# EAGLE design NDIR_SensorInterface (EAGLE 9.6.2)
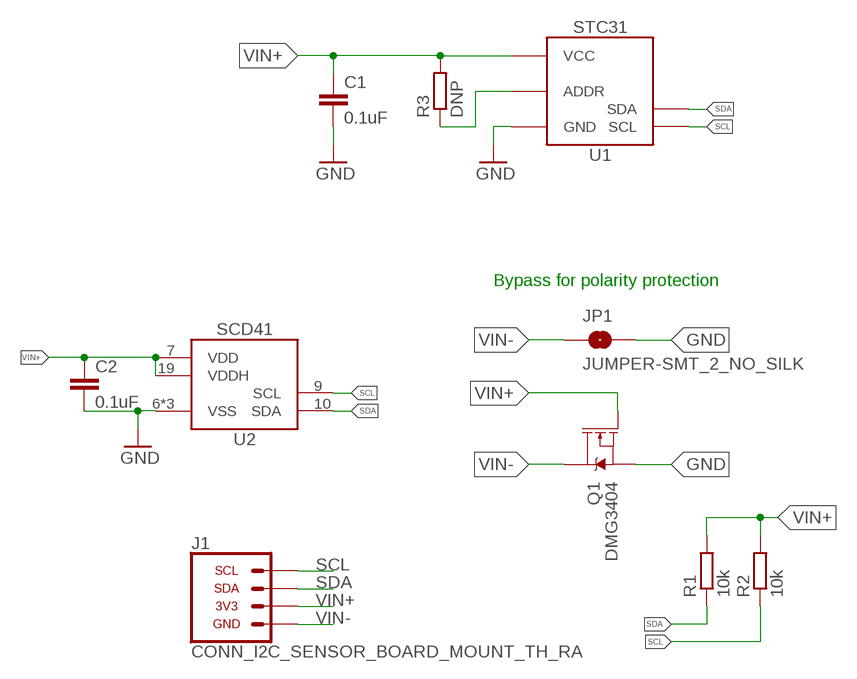
[diagram p0: schematic, sheet 1]

## Parts
C1  0.1uF  C-EU0.1UFC0603  [C0603]
C2  0.1uF  C-EU0.1UFC0603  [C0603]
J1  CONN_I2C_SENSOR_BOARD_MOUNT_TH_RA  [CONEC_43-01204]
JP1  JUMPER-SMT_2_NO_SILK  [SMT-JUMPER_2_NO_SILK]
Q1  DMG3404  MOSFET-NCH-DMG3404L  [SOT23-3]
R1  10k  R-EU_10KR0603  [R0603]
R2  10k  R-EU_10KR0603  [R0603]
R3  DNP  R-EU_R0603  [R0603]
U1  STC31  [STC31]
U2  SCD41  [SCD4X]

## Nets
GND: C1.2 C2.2 JP1.2 Q1.2(S) U1.1(GND) U1.5(GND) U1.9(GND) U1.11(GND) U1.EP(GND) U2.6(VSS) U2.20(VSS) U2.EP(VSS)
N$2: R3.1 U1.3(ADDR)
SCL: J1.3(SCL) R2.1 U1.4(SCL) U2.9(SCL)
SDA: J1.1(SDA) R1.1 U1.7(SDA) U2.10(SDA)
VIN+: C1.1 C2.1 J1.2(3V3) Q1.1(G) R1.2 R2.2 R3.2 U1.6(VCC) U2.7(VDD) U2.19(VDDH)
VIN-: J1.4(GND) JP1.1 Q1.3(D)

## Notes on the sheet
- Bypass for polarity protection

## Library data of the parts
C1 C2 = bschulz_passives:C-EU: CAPACITOR, European symbol; DIGIKEY: 490-6051-1-ND; MF: Murata; MPN: GCM188R71E104KA57D
J1 = GEMS_Plugs:CONN_I2C_SENSOR: GEMS Connector for I2C Devices - Sensor Side; DIGIKEY: 626-2136-ND; MF: Conec; MPN: 43-01204
JP1 = bschulz:JUMPER-SMT_2_NO: Normally open jumper This jumper has two pads in close proximity to each other. Apply solder to close the connection. Round pads are easier to solder for beginners, but are a lot larger. SparkFun Product that uses the round pads: SparkFun EL Sequencer <https://www.sparkfun.com/products/12781>; DIGIKEY: DNP; MF: N/A; MPN: N/A
Q1 = bschulz:MOSFET-NCH: N-channel MOSFETs Voltage controlled devices that allow control of high current outputs. SparkFun Products: SparkFun OpenScale <https://www.sparkfun.com/products/13261> SparkFun Digital Sandbox <https://www.sparkfun.com/products/12651> SparkFun Monster Moto Shield <https://www.sparkfun.com/products/10182> SparkFun MOSFET Power Controller <https://www.sparkfun.com/products/11214>; DIGIKEY: DMG3404L-7DICT-ND; MF: Diodes Incorporated; MPN: DMG3404L-7
R1 R2 = bschulz_passives:R-EU_: RESISTOR, European symbol Digikey Parts: Yageo, 0402 <https://www.digikey.com/products/en/resistors/chip-resistor-surface-mount/52?k=&pkeyword=&sv=0&s=4356&sf=1&FV=-1%7C13%2C7%7C2%2C1291%7C39157%2C1989%7C0%2C-8%7C52%2C3%7C1131%2C3%7C2503&quantity=&ColumnSort=0&page=1&stock=1&pageSize=25> Yageo, 0603 <https://www.digikey.com/products/en/resistors/chip-resistor-surface-mount/52?k=&pkeyword=&sv=0&pv1291=39245&sf=1&FV=-5%7C4356%2C-5%7C47360%2C-8%7C52%2C-1%7C13%2C7%7C2%2C1989%7C0&quantity=10&ColumnSort=1000011&page=1&stock=1&pageSize=25> Panasonic, 0603 <https://www.digikey.com/products/en/resistors/chip-resistor-surface-mount/52?k=&pkeyword=&pv252=68&sf=0&FV=ffec373d%2C1c0002%2C142c040c%2C1f140000%2Cffe00034%2C80002%2Cc0001&quantity=&ColumnSort=0&page=1&stock=1&pageSize=25> Panasonic, precision, 0603 <https://www.digikey.com/products/en/resistors/chip-resistor-surface-mount/52?FV=ffec4907%2Cfffc000a%2Cc0172%2C142c040c%2C1f140000%2Cffe00034%2C1c0002&quantity=100&ColumnSort=2085&page=1&stock=1&pageSize=25> Panasonic, 0805 <https://www.digikey.com/products/en/resistors/chip-resistor-surface-mount/52?k=&pkeyword=&pv3=1&sf=0&FV=ffec373d%2C1c0002%2C1f140000%2Cffe00034%2C142c040d&quantity=&ColumnSort=0&page=1&stock=1&pageSize=25> Rohm, current sense <https://www.digikey.com/products/en/resistors/chip-resistor-surface-mount/52?k=&pkeyword=&pv3=1&sf=0&FV=ffecb688%2C1f140000%2Cffe00034%2C1c0002&quantity=&ColumnSort=0&page=1&stock=1&pageSize=25> Vishay, pulse proof automotive <https://www.digikey.com/products/en/resistors/chip-resistor-surface-mount/52?k=&pkeyword=&pv7=2&sf=0&FV=ffec5d6b%2Cffe00034%2C1f140000&quantity=&ColumnSort=0&page=1&stock=1&pageSize=25>; DIGIKEY: 311-10.0KHRCT-ND; MF: Yageo; MPN: RC0603FR-0710KL; VALUE_PART: 10k
R3 = bschulz_passives:R-EU_: RESISTOR, European symbol Digikey Parts: Yageo, 0402 <https://www.digikey.com/products/en/resistors/chip-resistor-surface-mount/52?k=&pkeyword=&sv=0&s=4356&sf=1&FV=-1%7C13%2C7%7C2%2C1291%7C39157%2C1989%7C0%2C-8%7C52%2C3%7C1131%2C3%7C2503&quantity=&ColumnSort=0&page=1&stock=1&pageSize=25> Yageo, 0603 <https://www.digikey.com/products/en/resistors/chip-resistor-surface-mount/52?k=&pkeyword=&sv=0&pv1291=39245&sf=1&FV=-5%7C4356%2C-5%7C47360%2C-8%7C52%2C-1%7C13%2C7%7C2%2C1989%7C0&quantity=10&ColumnSort=1000011&page=1&stock=1&pageSize=25> Panasonic, 0603 <https://www.digikey.com/products/en/resistors/chip-resistor-surface-mount/52?k=&pkeyword=&pv252=68&sf=0&FV=ffec373d%2C1c0002%2C142c040c%2C1f140000%2Cffe00034%2C80002%2Cc0001&quantity=&ColumnSort=0&page=1&stock=1&pageSize=25> Panasonic, precision, 0603 <https://www.digikey.com/products/en/resistors/chip-resistor-surface-mount/52?FV=ffec4907%2Cfffc000a%2Cc0172%2C142c040c%2C1f140000%2Cffe00034%2C1c0002&quantity=100&ColumnSort=2085&page=1&stock=1&pageSize=25> Panasonic, 0805 <https://www.digikey.com/products/en/resistors/chip-resistor-surface-mount/52?k=&pkeyword=&pv3=1&sf=0&FV=ffec373d%2C1c0002%2C1f140000%2Cffe00034%2C142c040d&quantity=&ColumnSort=0&page=1&stock=1&pageSize=25> Rohm, current sense <https://www.digikey.com/products/en/resistors/chip-resistor-surface-mount/52?k=&pkeyword=&pv3=1&sf=0&FV=ffecb688%2C1f140000%2Cffe00034%2C1c0002&quantity=&ColumnSort=0&page=1&stock=1&pageSize=25> Vishay, pulse proof automotive <https://www.digikey.com/products/en/resistors/chip-resistor-surface-mount/52?k=&pkeyword=&pv7=2&sf=0&FV=ffec5d6b%2Cffe00034%2C1f140000&quantity=&ColumnSort=0&page=1&stock=1&pageSize=25>; MF: Yageo
U1 = bschulz:STC31: STC31 - Thermal Conductivity CO2 Gas Sensor Sensor Characteristics: Vcc: 2.7 ~ 5.5V Sensing: CO2, Temperature Range: 0 ~ 100% (CO2) Sample Rate: >1Hz Operating Temperature: -40°C to 105°C Digikey: 1649-STC31-C-R3CT-ND <https://www.digikey.com/en/products/detail/sensirion-ag/STC31-C-R3/24394079>; DIGIKEY: 1649-STC31-C-R3CT-ND; DISP: STC31; MF: Sensirion; MPN: STC31-C-R3
U2 = bschulz:SCD4*: SCD4x - Miniature NDIR CO2 Sensor Characteristics: Vcc: 2.4 ~ 5.5V Sensing: CO2, Temperature, Humidity Range: 0 ~ 40000 ppm (CO2) Sample Rate: <5s Operating Temperature: -10°C to 60°C Digikey: 1649-SCD40-D-R2CT-ND <https://www.digikey.com/en/products/detail/sensirion-ag/SCD40-D-R2/13684003> 1649-SCD41-D-R2CT-ND <https://www.digikey.com/en/products/detail/sensirion-ag/SCD41-D-R2/13684005>; DIGIKEY: 1649-SCD41-D-R2CT-ND; DISP: SCD41; MF: Sensirion; MPN: SCD41-D-R2

## Board
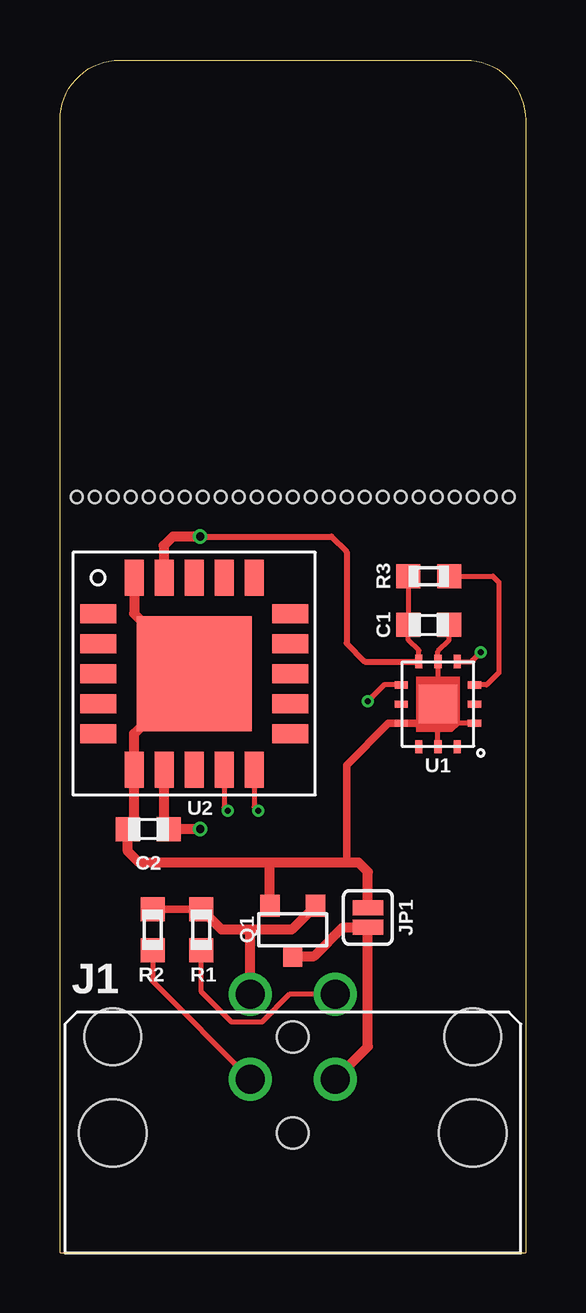
[diagram p1: board, top side]
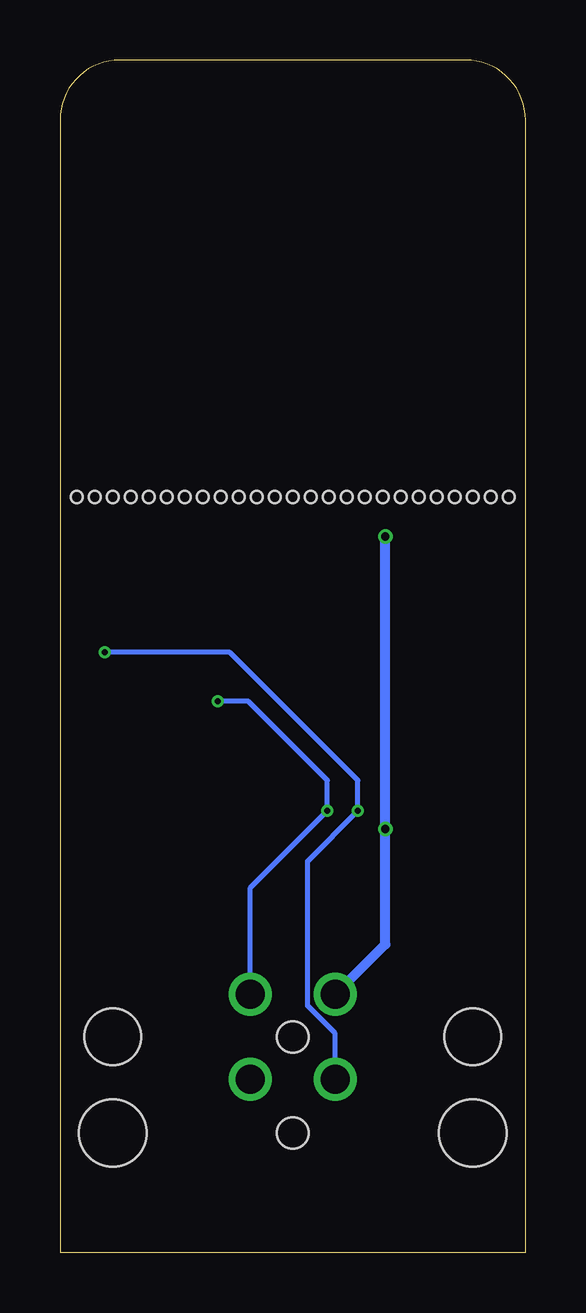
[diagram p2: board, bottom side, seen from below]

Size 19.4 x 49.7 mm. Coordinates in mm from the lower left corner, seen from the top.
Outline: 0,0 19.4,0 19.4,47.2 arc90 16.9,49.7 2.5,49.7 arc90 0,47.2 0,0
Copper layers (1*16): Top 0.035559375mm / dielectric 1.6mm / Bottom 0.035559375mm
Design rules "oshpark-2layer": minimum track width 6mil, minimum drill 10mil, track to track 6mil, track to pad 6mil, pad to pad 6mil, via to via 6mil, smd to smd 6mil, copper to edge 15mil, drill to drill 6mil, minimum pad ring 5mil, minimum via ring 5mil, stop-mask expansion 2.5mil, vias tented up to drill 0mil, thermal gap 10mil
Holes 0.5 mm at 9.7,31.5 10.45,31.5 11.2,31.5 11.95,31.5 12.7,31.5 13.45,31.5 14.2,31.5 14.95,31.5 15.7,31.5 16.45,31.5 17.2,31.5 17.95,31.5 18.7,31.5 8.95,31.5 8.2,31.5 7.45,31.5 6.7,31.5 5.95,31.5 5.2,31.5 4.45,31.5 3.7,31.5 2.95,31.5 2.2,31.5 1.45,31.5 0.7,31.5

### Footprints (pad centres in the part's own frame; a part is rotated, then mirrored left to right if it is on the bottom)
C0603 = smd 1 x 1: 1 -0.85,0; 2 0.85,0
CONEC_43-01204 = drill 1.2: 1 -1.768,-10.768; 2 1.768,-10.768; 3 1.768,-7.232; 4 -1.768,-7.232 | hole 2.8: -7.5,-5; 7.5,-5 | hole 2.35: -7.5,-9; 7.5,-9 | hole 1.3: 0,-5; 0,-9
SMT-JUMPER_2_NO_SILK = smd 0.635 x 1.27: 1 -0.406,0; 2 0.406,0
SOT23-3 = smd 0.8 x 0.9: 1 -0.95,-1; 2 0.95,-1; 3 0,1.1
R0603 = smd 1 x 1: 1 -0.85,0; 2 0.85,0
STC31 = smd 0.55 x 0.3: 1 -1.525,0.8; 2 -1.525,0; 3 -1.525,-0.8; 7 1.525,-0.8; 8 1.525,0; 9 1.525,0.8 | smd 0.3 x 0.55: 4 -0.8,-1.775; 5 0,-1.775; 6 0.8,-1.775; 10 0.8,1.775; 11 0,1.775; 12 -0.8,1.775 | smd 1.6 x 1.6: EP 0,0
SCD4X = smd 1.5 x 0.8: 1 -4,2.5; 2 -4,1.25; 3 -4,0; 4 -4,-1.25; 5 -4,-2.5; 11 4,-2.5; 12 4,-1.25; 13 4,0; 14 4,1.25; 15 4,2.5 | smd 0.8 x 1.5: 6 -2.5,-4; 7 -1.25,-4; 8 0,-4; 9 1.25,-4; 10 2.5,-4; 16 2.5,4; 17 1.25,4; 18 0,4; 19 -1.25,4; 20 -2.5,4 | smd 4.8 x 4.8: EP 0,0

### Placement (x,y rotation side)
C1  15.37,26.16 0 top
C2  3.68,17.65 180 top
J1  9.7,0 180 top
JP1  12.83,13.97 90 top
Q1  9.7,13.46 180 top
R1  5.89,13.46 90 top
R2  3.86,13.46 90 top
R3  15.37,28.19 180 top
U1  15.75,22.86 180 top
U2  5.59,24.13 0 top

### Tracks (layer width: path | path; a pad name or v marks a point on that pad's centre or on a via)
GND
  Top 0.2: U1.1 16.55,22.06 U1.EP | U1.11 U1.EP | U1.EP U1.5 15.75,25.06 16.22,25.53 C1.2
  Top 0.305: 11.94,16.27 11.94,20.32 13.68,22.06 U1.9 14.95,22.06 U1.EP
  Top 0.406: JP1.2 12.83,15.88 12.43,16.27 11.94,16.27 8.76,16.27 8.75,16.25 | Q1.2 8.75,16.25 | 8.75,16.25 3.3,16.25 2.83,16.73 C2.2 3.09,17.91 U2.6 3.09,21.63 U2.EP 3.09,26.63 U2.20
N$2
  Top 0.2: R3.1 18.03,28.19 18.29,27.94 18.29,24.17 17.78,23.66 U1.3
SCL  (via drill 0.25)
  Top 0.2: U1.4 17.14,24.64 v17.53,25.02 | R2.1 3.86,11.31 J1.3 | U2.9 6.84,18.56 v6.99,18.41
  Bottom 0.2: v17.53,25.02 12.32,25.02 6.99,19.68 v6.99,18.41 9.08,16.32 9.08,10.29 7.93,9.14 J1.3
SDA  (via drill 0.25)
  Top 0.2: U1.7 13.5,23.66 v12.83,22.99 | J1.1 9.56,10.77 8.41,9.62 7.15,9.62 5.89,10.88 R1.1 | U2.10 8.09,18.58 v8.26,18.41
  Bottom 0.2: v12.83,22.99 11.56,22.99 8.26,19.68 v8.26,18.41 11.47,15.2 J1.1
VIN+  (via drill 0.35)
  Top 0.2: U1.6 14.95,25.1 14.52,25.53 C1.1 R3.2
  Top 0.254: v5.84,29.84 11.3,29.84 11.94,29.21 11.94,25.4 12.7,24.64 U1.6
  Top 0.305: R2.2 R1.2
  Top 0.406: Q1.1 9.65,13.46 7.87,13.46 | R1.2 6.74,13.46 7.87,13.46 | J1.2 7.93,13.41 7.87,13.46 | v5.84,17.65 C2.1 4.34,17.85 U2.7 | v5.84,29.84 4.7,29.84 4.32,29.46 4.32,28.15 U2.19
  Bottom 0.406: J1.2 5.84,12.86 v5.84,17.65 v5.84,29.84
VIN-
  Top 0.406: J1.4 12.83,8.59 JP1.1 11.79,13.56 10.58,12.36 Q1.3

### Text on the board
bDocu: Project Hedorah / Mk3 / SCD41/STC31 / v0.0 | Creature of Slime and Sludge / Spawned by Pollution's Poison / Threatens to Destroy the Earth!